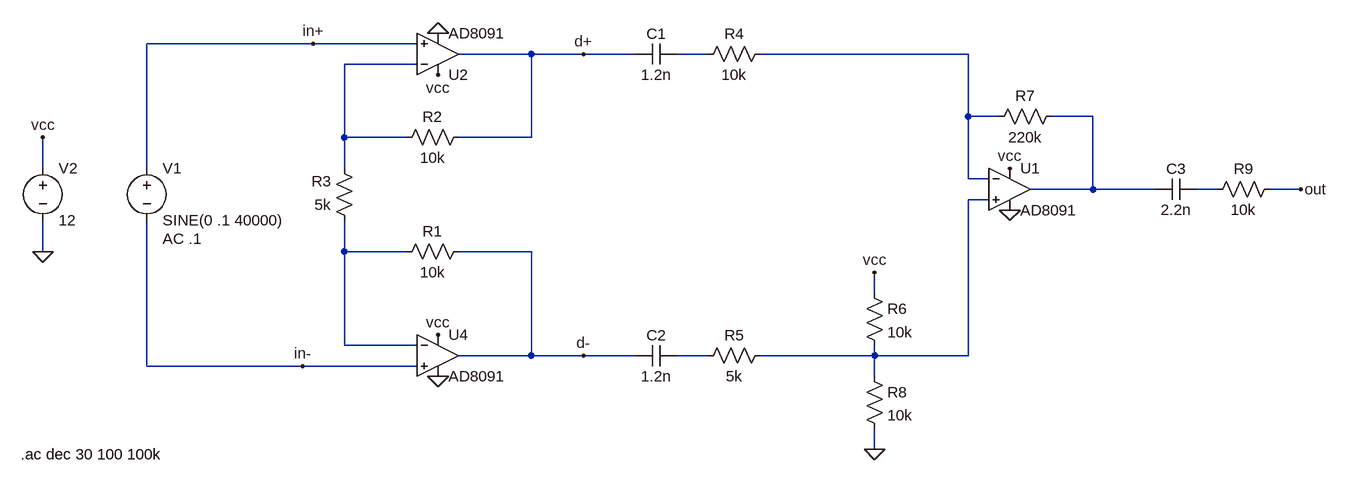
[diagram p0: schematic amplifier.asc]
amplifier.asc, the LTspice schematic file:
Version 4
SHEET 1 1432 680
WIRE -144 0 -400 0
WIRE 16 0 -144 0
WIRE 192 16 80 16
WIRE 272 16 192 16
WIRE 352 16 272 16
WIRE 464 16 416 16
WIRE 864 16 544 16
WIRE 16 32 -96 32
WIRE 864 112 864 16
WIRE 912 112 864 112
WIRE 1056 112 992 112
WIRE -96 144 -96 32
WIRE 0 144 -96 144
WIRE 192 144 192 16
WIRE 192 144 80 144
WIRE -560 192 -560 144
WIRE -400 192 -400 0
WIRE -96 192 -96 144
WIRE 864 208 864 112
WIRE 896 208 864 208
WIRE 1056 224 1056 112
WIRE 1056 224 960 224
WIRE 1152 224 1056 224
WIRE 1248 224 1216 224
WIRE 1376 224 1328 224
WIRE 896 240 864 240
WIRE -560 320 -560 272
WIRE -96 320 -96 272
WIRE 0 320 -96 320
WIRE 192 320 80 320
WIRE 720 384 720 352
WIRE -96 464 -96 320
WIRE 16 464 -96 464
WIRE 192 480 192 320
WIRE 192 480 80 480
WIRE 272 480 192 480
WIRE 352 480 272 480
WIRE 464 480 416 480
WIRE 720 480 720 464
WIRE 720 480 544 480
WIRE 864 480 864 240
WIRE 864 480 720 480
WIRE -400 496 -400 272
WIRE -160 496 -400 496
WIRE 16 496 -160 496
WIRE 720 512 720 480
WIRE 720 624 720 592
FLAG -560 320 0
FLAG -560 144 vcc
FLAG 48 48 vcc
FLAG 48 448 vcc
FLAG 48 -16 0
FLAG 48 512 0
FLAG -144 0 in+
FLAG -160 496 in-
FLAG 272 16 d+
FLAG 272 480 d-
FLAG 928 256 0
FLAG 928 192 vcc
FLAG 1376 224 out
FLAG 720 624 0
FLAG 720 352 vcc
SYMBOL res 96 304 R90
WINDOW 0 0 56 VBottom 2
WINDOW 3 32 56 VTop 2
SYMATTR InstName R1
SYMATTR Value 10k
SYMBOL res 96 128 R90
WINDOW 0 0 56 VBottom 2
WINDOW 3 32 56 VTop 2
SYMATTR InstName R2
SYMATTR Value 10k
SYMBOL res -80 288 R180
WINDOW 0 36 76 Left 2
WINDOW 3 36 40 Left 2
SYMATTR InstName R3
SYMATTR Value 5k
SYMBOL voltage -400 176 R0
WINDOW 123 24 124 Left 2
WINDOW 39 0 0 Left 0
SYMATTR InstName V1
SYMATTR Value SINE(0 .1 40000)
SYMATTR Value2 AC .1
SYMBOL voltage -560 176 R0
SYMATTR InstName V2
SYMATTR Value 12
SYMBOL cap 416 0 R90
WINDOW 0 0 32 VBottom 2
WINDOW 3 32 32 VTop 2
SYMATTR InstName C1
SYMATTR Value 1.2n
SYMBOL cap 416 464 R90
WINDOW 0 0 32 VBottom 2
WINDOW 3 32 32 VTop 2
SYMATTR InstName C2
SYMATTR Value 1.2n
SYMBOL res 560 0 R90
WINDOW 0 0 56 VBottom 2
WINDOW 3 32 56 VTop 2
SYMATTR InstName R4
SYMATTR Value 10k
SYMBOL res 560 464 R90
WINDOW 0 0 56 VBottom 2
WINDOW 3 32 56 VTop 2
SYMATTR InstName R5
SYMATTR Value 5k
SYMBOL res 1008 96 R90
WINDOW 0 0 56 VBottom 2
WINDOW 3 32 56 VTop 2
SYMATTR InstName R7
SYMATTR Value 220k
SYMBOL res 704 496 R0
SYMATTR InstName R8
SYMATTR Value 10k
SYMBOL OpAmps\\AD8091 48 416 R0
SYMATTR InstName U4
SYMBOL OpAmps\\AD8091 928 160 R0
SYMATTR InstName U1
SYMBOL OpAmps\\AD8091 48 80 M180
SYMATTR InstName U2
SYMBOL res 704 368 R0
SYMATTR InstName R6
SYMATTR Value 10k
SYMBOL cap 1216 208 R90
WINDOW 0 0 32 VBottom 2
WINDOW 3 32 32 VTop 2
SYMATTR InstName C3
SYMATTR Value 2.2n
SYMBOL res 1344 208 R90
WINDOW 0 0 56 VBottom 2
WINDOW 3 32 56 VTop 2
SYMATTR InstName R9
SYMATTR Value 10k
TEXT -594 632 Left 2 !.ac dec 30 100 100k

The netlist it stands for:
* amplifier.asc
R1 d- N007 10k
R2 d+ N003 10k
R3 N007 N003 5k
V1 in+ in- SINE(0 .1 40000) AC .1
V2 vcc 0 12
C1 N001 d+ 1.2n
C2 N008 d- 1.2n
R4 N002 N001 10k
R5 N006 N008 5k
R7 N004 N002 220k
R8 N006 0 10k
XU4 in- N007 vcc 0 d- AD8091  ; pins In+ In- V+ V- OUT
XU1 N006 N002 vcc 0 N004 AD8091  ; pins In+ In- V+ V- OUT
XU2 in+ N003 vcc 0 d+ AD8091  ; pins In+ In- V+ V- OUT
R6 vcc N006 10k
C3 N005 N004 2.2n
R9 out N005 10k
.ac dec 30 100 100k
.backanno
.end